# EAGLE design MySens-easyRS485-BluePill-V03-not-ordered-015 (EAGLE 7.6.0)
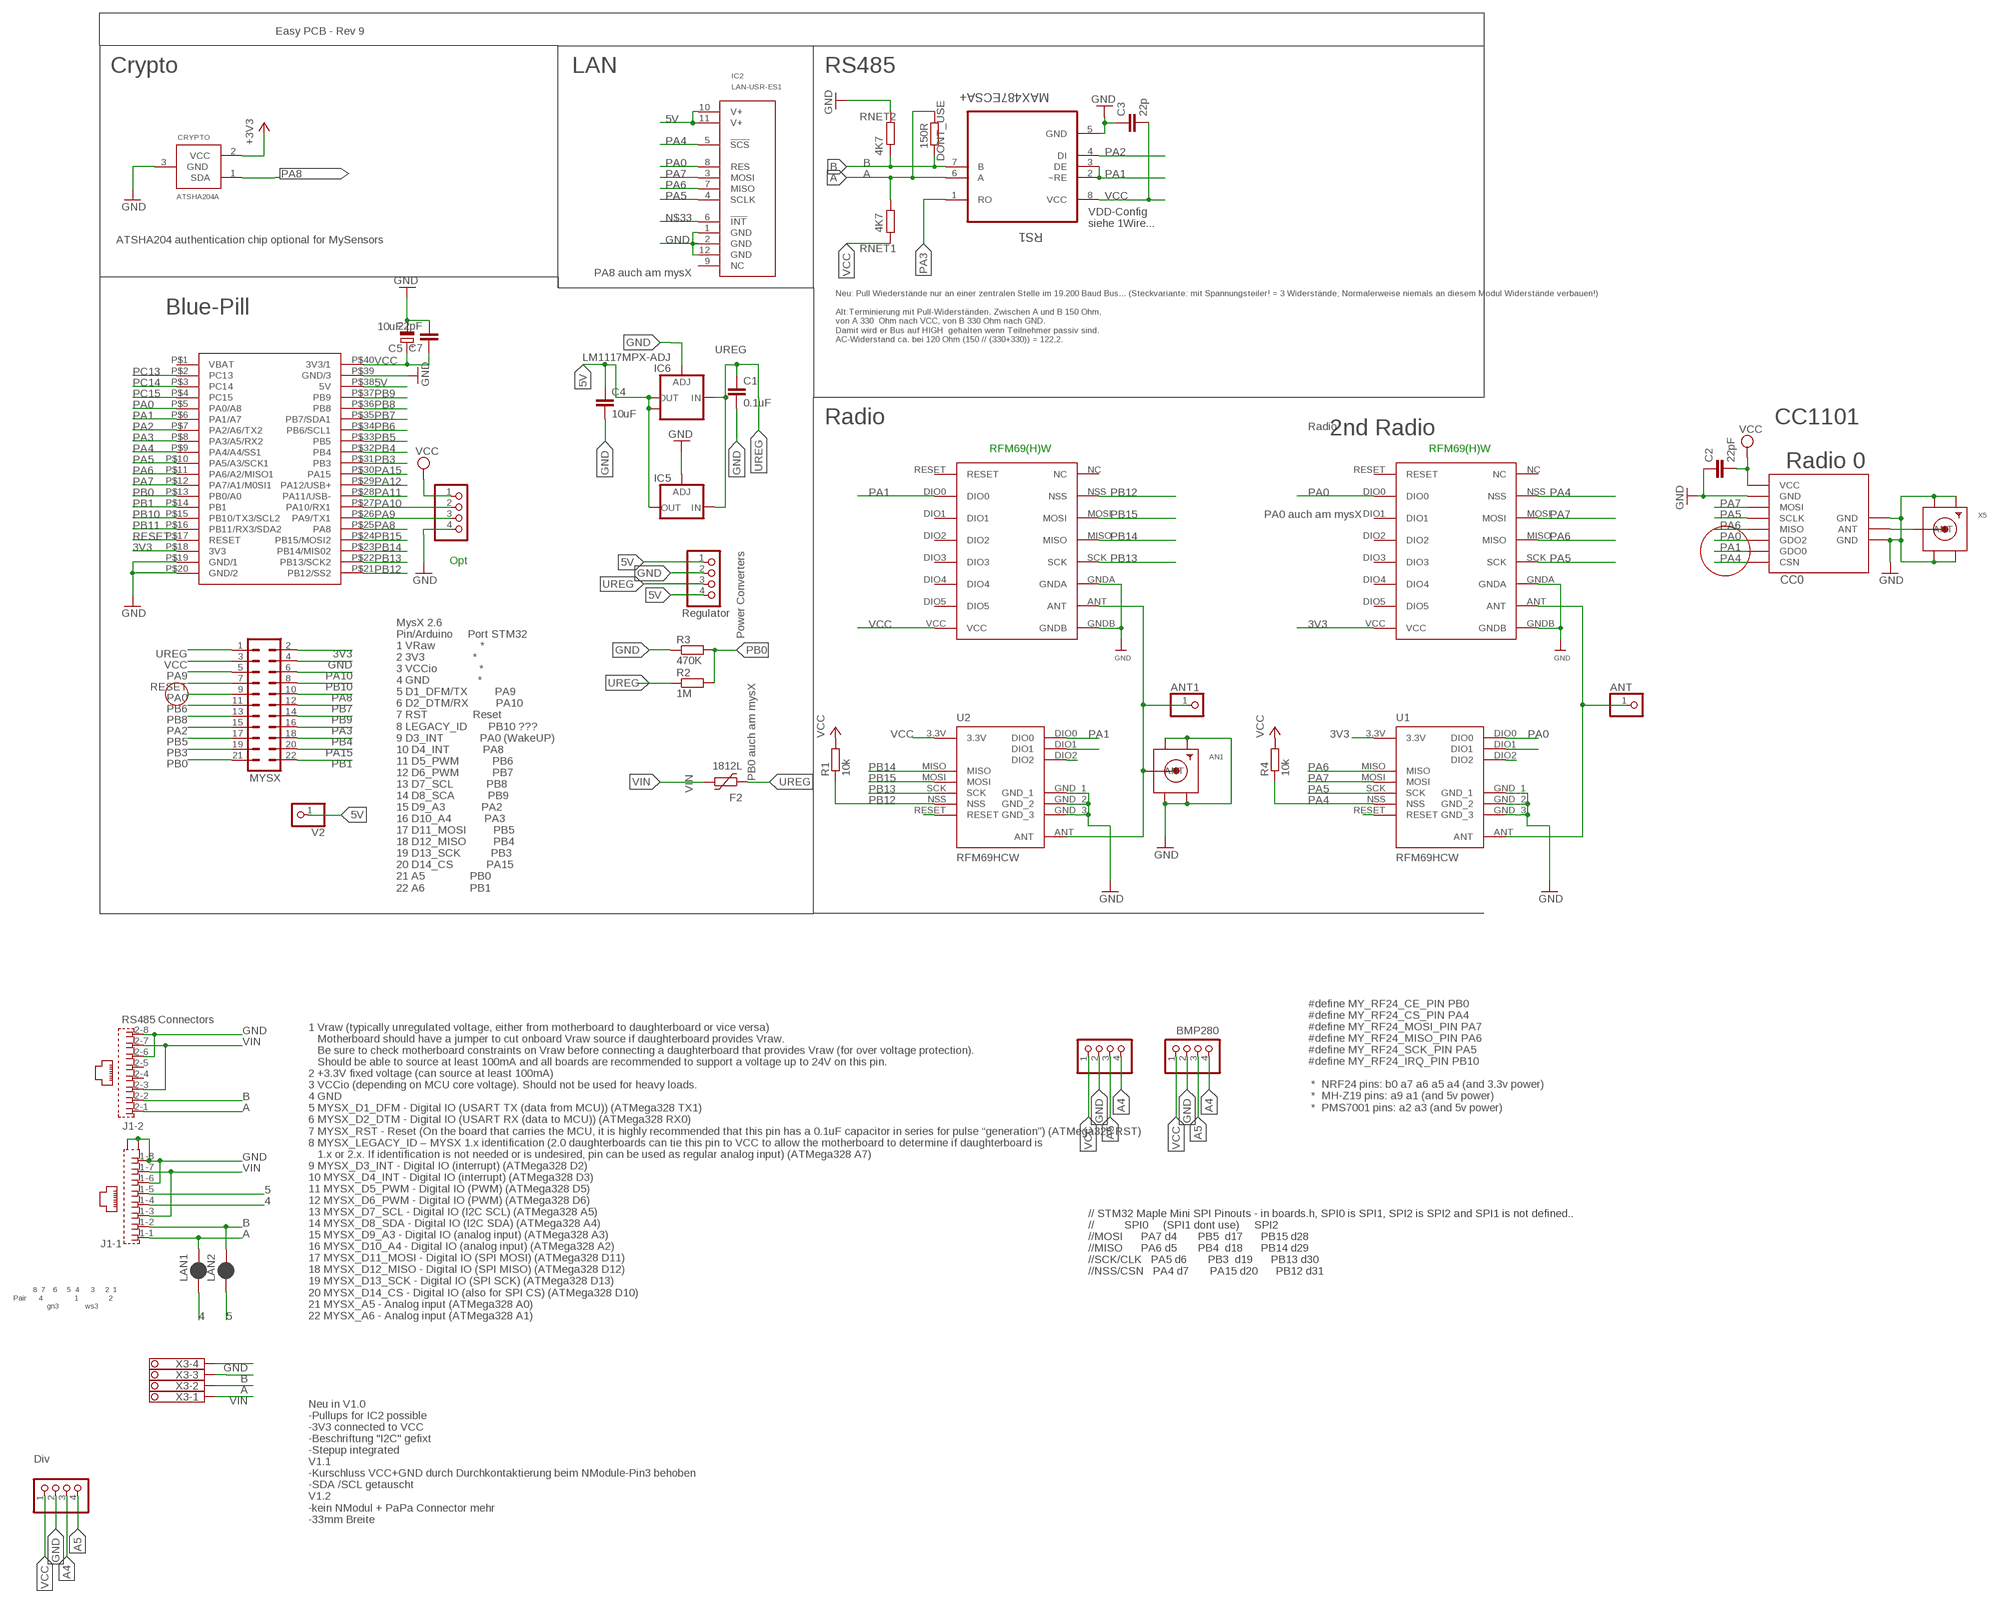
[diagram p0: schematic, sheet 1]

## Parts
AN1  SMACONNECTOR_EDGE  [SMA_EDGELAUNCH]
ANT  PINHD-1X1  [1X01]
ANT1  PINHD-1X1  [1X01]
BH1750  PINHD-1X04_2.54-S  [1X04-S]
C1  0.1uF  C-EUC1206  [C1206]
C2  22pF  C-EUC0805  [C0805]
C3  22p  C-EUC0805  [C0805]
C4  10uF  C-EUC1210  [C1210]
C5  10uF  CPOL-EUR/2012-12W  [R/2012-12W]
C7  22pF  C-EUC0805  [C0805]
CC0  CC1101  CC1101_MODULE1SMD  [CC1101_MODULE1_SMD]
CRYPTO  ATSHA204A  [SOT23]
DBG  PINHD-1X04_2.54-S  [1X04-S]
DONT_USE  150R  R-EU_R0805  [R0805]
F2  1812L  [1812L]
I2C-1  PINHD-1X04_2.54-S  [1X04-S]
I2C-2  PINHD-1X04_2.54-S  [1X04-S]
IC2  LAN-USR-ES1  [USR-ES1]
IC5  LD117ADT50TR  [DPACK]
IC6  LM1117MPX-ADJ  [SOT223]
J1  RJ45_2X_NARROW_SHILDPINS_NOCASE  [RJ45_2X_NARROW_SHILDPINS_NOCASE]
LAN1  JUMPER-SMT_2_NC_PASTE_SILK  [SMT-JUMPER_2_NC_PASTE_SILK]
LAN2  JUMPER-SMT_2_NC_PASTE_SILK  [SMT-JUMPER_2_NC_PASTE_SILK]
MYSX  MA11-2  [MA11-2]
R1  10k  R-EU_M0805  [M0805]
R2  1M  R-EU_R0805  [R0805]
R3  470K  R-EU_R0805  [R0805]
R4  10k  R-EU_M0805  [M0805]
RFM69W  RFM69HW  [RFM]
RFM69W1  RFM69HW  [RFM]
RNET1  4K7  R-EU_R0805  [R0805]
RNET2  4K7  R-EU_R0805  [R0805]
RS1  MAX487ECSA+  [SOIC127P600X175-8N]
STEPDWN  PINHD-1X04_2.54-S  [1X04-S]
U1  RFM69HCW  [RFM69HCW-XXXS2]
U2  RFM69HCW  [RFM69HCW-XXXS2]
U$4  BLUEPILL  [BLUEPILL]
V2  PINHD-1X1  [1X01]
X3  1751264  [1751264]
X5  SMACONNECTOR_EDGE  [SMA_EDGELAUNCH]

## Nets
3V3: CRYPTO.2(VCC) MYSX.2 RFM69W.VCC U1.3.3V U$4.P$18(3V3) ; supply symbol labelled +3V3
4: J1.1-4 LAN1.1
5: J1.1-5 LAN2.1
5V: C4.1 IC2.10(V+) IC2.11(V+) IC5.4(OUT) IC6.2(OUT) IC6.TAB(OUT1) STEPDWN.1 STEPDWN.4 U$4.P$38(5V) V2.1
A: DONT_USE.1 J1.1-1 J1.2-1 LAN1.2 RNET1.2 RS1.6(A) X3.2
A4: BH1750.4 I2C-1.4 I2C-2.3
A5: BH1750.3 I2C-1.3 I2C-2.4
ANT0: CC0.ANT X5.P(ANT)
ANT1: AN1.P(ANT) ANT1.1 RFM69W1.ANT U2.ANT
ANT2: ANT.1 RFM69W.ANT U1.ANT
B: DONT_USE.2 J1.1-2 J1.2-2 LAN2.2 RNET2.1 RS1.7(B) X3.3
GND [PWR]: AN1.GND@1(GND4) AN1.GND@2(GND3) AN1.GND@3(GND2) AN1.GND@4(GND1) BH1750.2 C1.2 C2.1 C3.1 C4.2 C5.- C7.2 CC0.GND@0(GND) CC0.GND@1(GND) CC0.GND@2(GND) CRYPTO.3(GND) DBG.4 I2C-1.2 I2C-2.2 IC2.1(GND) IC2.2(GND) IC2.12(GND) IC5.1(ADJ) IC6.1(ADJ) J1.1-6 J1.1-8 J1.2-6 J1.2-8 J1.G1(-1:S1) J1.G3(-1:S2) MYSX.4 R3.1 RFM69W1.GNDA RFM69W1.GNDB RFM69W.GNDA RFM69W.GNDB RNET2.2 RS1.5(GND) STEPDWN.2 U1.GND_1 U1.GND_2 U1.GND_3 U2.GND_1 U2.GND_2 U2.GND_3 U$4.P$19(GND/1) U$4.P$20(GND/2) U$4.P$39(GND/3) X3.4 X5.GND@1(GND4) X5.GND@2(GND3) X5.GND@3(GND2) X5.GND@4(GND1)
N$1: U1.RESET
N$4: U2.DIO2
N$8: U2.DIO1
N$9: U2.RESET
N$14: U1.DIO2
N$15: U1.DIO1
N$33: IC2.6(!INT!)
PA0: CC0.GDO2 IC2.8(RES) MYSX.9 RFM69W.DIO0 U1.DIO0 U$4.P$5(PA0/A8)
PA1: CC0.GDO0 RFM69W1.DIO0 RS1.2(~RE) RS1.3(DE) U2.DIO0 U$4.P$6(PA1/A7)
PA2: MYSX.15 RS1.4(DI) U$4.P$7(PA2/A6/TX2)
PA3: MYSX.16 RS1.1(RO) U$4.P$8(PA3/A5/RX2)
PA4: CC0.CSN IC2.5(!SCS!) R4.1 RFM69W.NSS U1.NSS U$4.P$9(PA4/A4/SS1)
PA5: CC0.SCLK IC2.4(SCLK) RFM69W.SCK U1.SCK U$4.P$10(PA5/A3/SCK1)
PA6: CC0.MISO IC2.7(MISO) RFM69W.MISO U1.MISO U$4.P$11(PA6/A2/MISO1)
PA7: CC0.MOSI IC2.3(MOSI) RFM69W.MOSI U1.MOSI U$4.P$12(PA7/A1/M0SI1)
PA8: CRYPTO.1(SDA) MYSX.10 U$4.P$25(PA8)
PA9: DBG.3 MYSX.5 U$4.P$26(PA9/TX1)
PA10: DBG.2 MYSX.6 U$4.P$27(PA10/RX1)
PA11: U$4.P$28(PA11/USB-)
PA12: U$4.P$29(PA12/USB+)
PA15: MYSX.20 U$4.P$30(PA15)
PB0: MYSX.21 R2.2 R3.2 U$4.P$13(PB0/A0)
PB1: MYSX.22 U$4.P$14(PB1)
PB3: MYSX.19 U$4.P$31(PB3)
PB4: MYSX.18 U$4.P$32(PB4)
PB5: MYSX.17 U$4.P$33(PB5)
PB6: MYSX.11 U$4.P$34(PB6/SCL1)
PB7: MYSX.12 U$4.P$35(PB7/SDA1)
PB8: MYSX.13 U$4.P$36(PB8)
PB9: MYSX.14 U$4.P$37(PB9)
PB10: MYSX.8 U$4.P$15(PB10/TX3/SCL2)
PB11: U$4.P$16(PB11/RX3/SDA2)
PB12: R1.1 RFM69W1.NSS U2.NSS U$4.P$21(PB12/SS2)
PB13: RFM69W1.SCK U2.SCK U$4.P$22(PB13/SCK2)
PB14: RFM69W1.MISO U2.MISO U$4.P$23(PB14/MIS02)
PB15: RFM69W1.MOSI U2.MOSI U$4.P$24(PB15/MOSI2)
PC13: U$4.P$2(PC13)
PC14: U$4.P$3(PC14)
PC15: U$4.P$4(PC15)
RESET: MYSX.7 U$4.P$17(RESET)
UREG [PWR]: C1.1 F2.P$1 IC5.3(IN) IC6.3(IN) MYSX.1 R2.1 STEPDWN.3
VCC [PWR]: BH1750.1 C2.2 C3.2 C5.+ C7.1 CC0.VCC DBG.1 I2C-1.1 I2C-2.1 MYSX.3 R1.2 R4.2 RFM69W1.VCC RNET1.1 RS1.8(VCC) U2.3.3V U$4.P$40(3V3/1)
VIN [PWR]: F2.P$2 J1.1-3 J1.1-7 J1.2-3 J1.2-7 X3.1
Unconnected: IC2.9(NC) J1.2-4 J1.2-5 RFM69W1.DIO1 RFM69W1.DIO2 RFM69W1.DIO3 RFM69W1.DIO4 RFM69W1.DIO5 RFM69W1.NC RFM69W1.RESET RFM69W.DIO1 RFM69W.DIO2 RFM69W.DIO3 RFM69W.DIO4 RFM69W.DIO5 RFM69W.NC RFM69W.RESET U$4.P$1(VBAT)

## Notes on the sheet
- Easy PCB - Rev 9
- Crypto | LAN | RS485
- VDD-Config
  siehe 1Wire...
- ATSHA204 authentication chip optional for MySensors
- PA8 auch am mysX
- Blue-Pill
- Neu: Pull Wiederstände nur an einer zentralen Stelle im 19.200 Baud Bus... (Steckvariante: mit Spannungsteiler! = 3 Widerstände; Normalerweise niemals an diesem Modul Widerstände verbauen!)
  
  Alt:Terminierung mit Pull-Widerständen. Zwischen A und B 150 Ohm,
  von A 330  Ohm nach VCC, von B 330 Ohm nach GND. 
  Damit wird er Bus auf HIGH  gehalten wenn Teilnehmer passiv sind.
  AC-Widerstand ca. bei 120 Ohm (150 // (330+330)) = 122,2.
- Radio | CC1101
- Radio
- 2nd Radio
- RFM69(H)W | RFM69(H)W
- Radio 0
- PA0 auch am mysX
- Power Converters
- Opt
- Regulator
- PB0 auch am mysX
- MysX 2.6
  Pin/Arduino     Port STM32
  1 VRaw               *
  2 3V3                *
  3 VCCio              *
  4 GND                *
  5 D1_DFM/TX         PA9
  6 D2_DTM/RX         PA10
  7 RST               Reset
  8 LEGACY_ID       PB10 ??? 
  9 D3_INT            PA0 (WakeUP) 
  10 D4_INT           PA8 
  11 D5_PWM           PB6
  12 D6_PWM           PB7
  13 D7_SCL           PB8
  14 D8_SCA           PB9
  15 D9_A3            PA2 
  16 D10_A4           PA3 
  17 D11_MOSI         PB5 
  18 D12_MISO         PB4
  19 D13_SCK          PB3 
  20 D14_CS           PA15
  21 A5               PB0
  22 A6               PB1
- RS485 Connectors
- BMP280
- #define MY_RF24_CE_PIN PB0 
  #define MY_RF24_CS_PIN PA4 
  #define MY_RF24_MOSI_PIN PA7 
  #define MY_RF24_MISO_PIN PA6 
  #define MY_RF24_SCK_PIN PA5 
  #define MY_RF24_IRQ_PIN PB10
  
   *  NRF24 pins: b0 a7 a6 a5 a4 (and 3.3v power)
   *  MH-Z19 pins: a9 a1 (and 5v power)
   *  PMS7001 pins: a2 a3 (and 5v power)
- // STM32 Maple Mini SPI Pinouts - in boards.h, SPI0 is SPI1, SPI2 is SPI2 and SPI1 is not defined..
  //          SPI0     (SPI1 dont use)     SPI2
  //MOSI      PA7 d4       PB5  d17      PB15 d28
  //MISO      PA6 d5       PB4  d18      PB14 d29
  //SCK/CLK   PA5 d6       PB3  d19      PB13 d30
  //NSS/CSN   PA4 d7       PA15 d20      PB12 d31
- 8  7    6     5  4      3     2  1
  Pair      4                1               2
                   gn3             ws3
- 1 Vraw (typically unregulated voltage, either from motherboard to daughterboard or vice versa)
     Motherboard should have a jumper to cut onboard Vraw source if daughterboard provides Vraw. 
     Be sure to check motherboard constraints on Vraw before connecting a daughterboard that provides Vraw (for over voltage protection). 
     Should be able to source at least 100mA and all boards are recommended to support a voltage up to 24V on this pin.
  2 +3.3V fixed voltage (can source at least 100mA)
  3 VCCio (depending on MCU core voltage). Should not be used for heavy loads.
  4 GND
  5 MYSX_D1_DFM - Digital IO (USART TX (data from MCU)) (ATMega328 TX1)
  6 MYSX_D2_DTM - Digital IO (USART RX (data to MCU)) (ATMega328 RX0)
  7 MYSX_RST - Reset (On the board that carries the MCU, it is highly recommended that this pin has a 0.1uF capacitor in series for pulse “generation”) (ATMega328 RST)
  8 MYSX_LEGACY_ID – MYSX 1.x identification (2.0 daughterboards can tie this pin to VCC to allow the motherboard to determine if daughterboard is 
     1.x or 2.x. If identification is not needed or is undesired, pin can be used as regular analog input) (ATMega328 A7)
  9 MYSX_D3_INT - Digital IO (interrupt) (ATMega328 D2)
  10 MYSX_D4_INT - Digital IO (interrupt) (ATMega328 D3)
  11 MYSX_D5_PWM - Digital IO (PWM) (ATMega328 D5)
  12 MYSX_D6_PWM - Digital IO (PWM) (ATMega328 D6)
  13 MYSX_D7_SCL - Digital IO (I2C SCL) (ATMega328 A5)
  14 MYSX_D8_SDA - Digital IO (I2C SDA) (ATMega328 A4)
  15 MYSX_D9_A3 - Digital IO (analog input) (ATMega328 A3)
  16 MYSX_D10_A4 - Digital IO (analog input) (ATMega328 A2)
  17 MYSX_D11_MOSI - Digital IO (SPI MOSI) (ATMega328 D11)
  18 MYSX_D12_MISO - Digital IO (SPI MISO) (ATMega328 D12)
  19 MYSX_D13_SCK - Digital IO (SPI SCK) (ATMega328 D13)
  20 MYSX_D14_CS - Digital IO (also for SPI CS) (ATMega328 D10)
  21 MYSX_A5 - Analog input (ATMega328 A0)
  22 MYSX_A6 - Analog input (ATMega328 A1)
- Div
- Neu in V1.0
  -Pullups for IC2 possible
  -3V3 connected to VCC
  -Beschriftung "I2C" gefixt
  -Stepup integrated
  V1.1
  -Kurschluss VCC+GND durch Durchkontaktierung beim NModule-Pin3 behoben
  -SDA /SCL getauscht
  V1.2
  -kein NModul + PaPa Connector mehr
  -33mm Breite

## Library data of the parts
AN1 X5 = adafruit:SMACONNECTOR: SMA Connector 90° DIP SMA Connector, 50 Ohm (4UConnector: 07259)
ANT ANT1 V2 = pinhead:PINHD-1X1: PIN HEADER
BH1750 DBG I2C-1 I2C-2 STEPDWN = pinhead-2:PINHD-1X04: PIN HEADER
C1-C4 C7 = rcl:C-EU: CAPACITOR, European symbol
C5 = rcl:CPOL-EU: POLARIZED CAPACITOR, European symbol
CC0 = wireless:CC1101_MODULE1: CC1101 wireless module for 433/868 MHz (sold from Aliexpress). DIL version for mounting with pin header (and SMD soldering) and SMD only variant available.
CRYPTO = Sensor:ATSHA204A
DONT_USE R1-R4 RNET1 RNET2 = rcl:R-EU_: RESISTOR, European symbol
F2 = ptc-littlefuse:1812L
IC2 = Martin-Communication:LAN-USR-ES1
IC5 = v-reg:LD117A?*: Low drop fixed and adjustable positive voltage regulators 1 A Source: http://www.st.com/stonline/products/literature/ds/7194/ld1117axx.pdf
IC6 = lm1117:LM1117MPX-ADJ
J1 = RJ45:RJ45_2X_NARROW_SHILDPINS_NOCASE: RJ45 connector
LAN1 LAN2 = SparkFun-Jumpers:JUMPER-SMT_2_NC_PASTE: Normally closed solder jumper This jumper has an aperture in the stencil to allow solder paste to bridge the split in the wire so it's normally closed (NC). Wick off the solder to open the connection. Reapply solder to reclose the connection.
MYSX = con-Pinheader:MA11-2: PIN HEADER; OC_FARNELL: unknown; OC_NEWARK: unknown
RFM69W RFM69W1 = hoperf:RFM69HW
RS1 = Maxim_By_element14_Batch_1:MAX487ECSA+: Low-Power, Slew-Rate-Limited RS-485/RS-422 Transceivers; MPN: MAX487ECSA+; OC_FARNELL: 9724532; OC_NEWARK: 68K4803; PACKAGE: SOIC-8; SUPPLIER: Maxim
U1 U2 = doug:RFM69H
U$4 = stm32duino boards:BLUEPILL
X3 = con-phoenix-350:1751264: MKDS 1/ 4-3,5 Printklemme Nennstrom: 10 A Bemessungsspannung: 160 V Raster: 3,5 mm Polzahl: 4 Montageart: Löten Anschlussart: Schraubanschluss Anschlussrichtung vom Leiter zur Platine: 0° Source: http://eshop.phoenixcontact.com .. 1751264.pdf; MPN: 1751264; OC_FARNELL: unknown; OC_NEWARK: 10R0934

## Net classes
0 default: width 0.254 mm, clearance 0.205 mm
1 PWR: width 0.406 mm, clearance 0.205 mm to class 0, clearance 0.205 mm

## Board
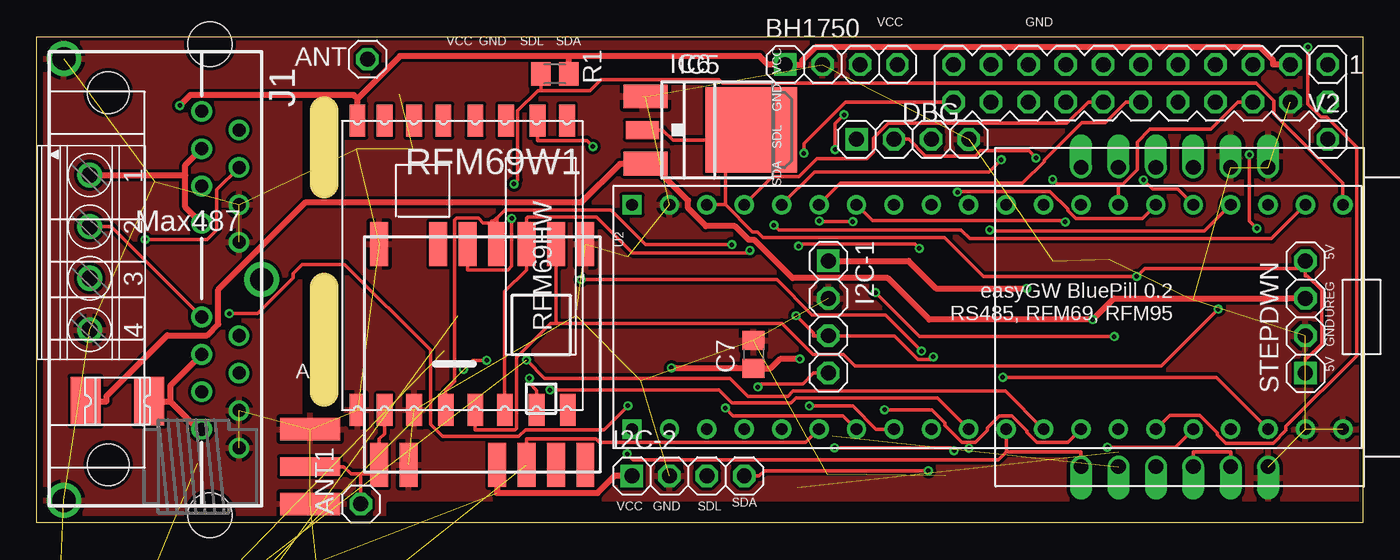
[diagram p1: board, top side]
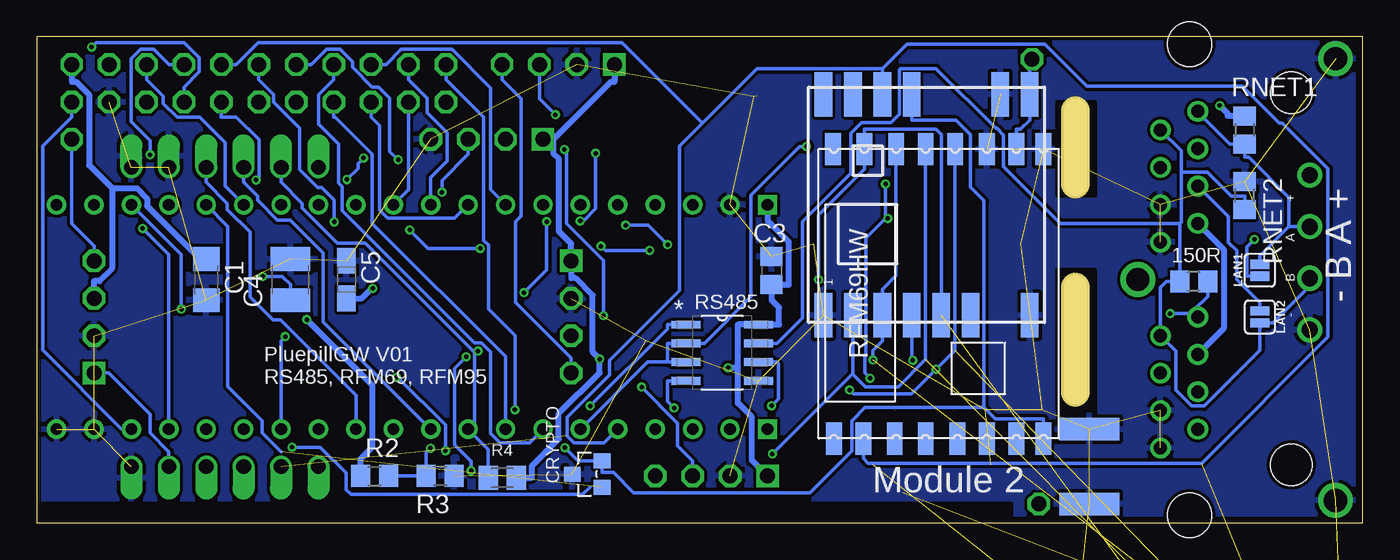
[diagram p2: board, bottom side, seen from below]

Size 90 x 33 mm. Coordinates in mm from the lower left corner, seen from the top.
Outline: 90,0 0,0 0,33 90,33 90,0
Copper layers (1*16): Top 0.035mm / dielectric 1.5mm / Bottom 0.035mm
Design rules "dirt_cheap_dirty_boards.v1": minimum track width 5mil, minimum drill 12mil, track to track 5mil, track to pad 5mil, pad to pad 5mil, via to via 5mil, smd to smd 0mil, copper to edge 10mil, drill to drill 10mil, minimum pad ring 10mil, minimum via ring 6mil, stop-mask expansion 2mil, vias tented up to drill 25mil, thermal gap 10mil
Holes 3 mm at 11.75,0.5 11.75,32.5
tRestrict: area 18.2,22.2 to 20.7,28.6; area 18.2,7.6 to 20.7,17.1; area 23.9,0.6 to 89.9,1.3; 1 lines
bRestrict: area 18.2,22.2 to 20.7,28.6; area 18.2,7.6 to 20.7,17.1; area 23.9,0.6 to 89.9,1.3
Milling: 2 lines

### Footprints (pad centres in the part's own frame; a part is rotated, then mirrored left to right if it is on the bottom)
SMA_EDGELAUNCH = smd 4.064 x 1.524: GND@1 2.032,-2.54; GND@2 2.032,2.54 | smd 4.064 x 1.524 bottom: GND@3 2.032,2.54; GND@4 2.032,-2.54 | smd 4.064 x 1.27: P 2.032,0
1X01 = drill 1.016 octagon: 1 0,0
1X04-S = drill 1.016 square: 1 -3.81,0 | drill 1.016 octagon: 2 -1.27,0; 3 1.27,0; 4 3.81,0
C1206 = smd 1.6 x 1.8: 1 -1.4,0; 2 1.4,0
C0805 = smd 1.3 x 1.5: 1 -0.95,0; 2 0.95,0
C1210 = smd 1.6 x 2.7: 1 -1.4,0; 2 1.4,0
R/2012-12W = smd 1.75 x 1.26: + 1.275,0; - -1.275,0
CC1101_MODULE1_SMD = smd 1.93 x 0.813: ANT 19,5.96; CSN 0,0; GDO0 0,2; GDO2 0,4; GND@0 0,12; GND@1 19,8.5; GND@2 19,3.42; MISO 0,6; MOSI 0,10; SCLK 0,8; VCC 0,14
SOT23 = smd 1.016 x 1.143: 1 -0.889,-1.016; 2 0.889,-1.016; 3 0,1.016
R0805 = smd 1.3 x 1.5: 1 -0.95,0; 2 0.95,0
1812L = smd 2.03 x 3.3: P$1 -2.16,0; P$2 2.16,0
USR-ES1 = drill 1 pad 1.35 offset: 1 -10.16,5.715; 2 -10.16,3.175; 3 -10.16,0.635; 4 -10.16,-1.905; 5 -10.16,-4.445; 6 -10.16,-6.985; 7 10.16,-6.985; 8 10.16,-4.445; 9 10.16,-1.905; 10 10.16,0.635; 11 10.16,3.175; 12 10.16,5.715
DPACK = smd 1.6 x 3: 1 -2.28,-4.8; 3 2.28,-4.8 | smd 5.8 x 6.2: 4 0,2.38
SOT223 = smd 1.219 x 2.235: 1 -2.311,-3.099; 2 0,-3.099; 3 2.311,-3.099 | smd 3.6 x 2.2: TAB 0,3.099
RJ45_2X_NARROW_SHILDPINS_NOCASE = drill 0.889: 1-1 -11.43,6.35; 1-2 -10.16,8.89; 1-3 -8.89,6.35; 1-4 -7.62,8.89; 1-5 -6.35,6.35; 1-6 -5.08,8.89; 1-7 -3.81,6.35; 1-8 -2.54,8.89; 2-1 2.54,6.35; 2-2 3.81,8.89; 2-3 5.08,6.35; 2-4 6.35,8.89; 2-5 7.62,6.35; 2-6 8.89,8.89; 2-7 10.16,6.35; 2-8 11.43,8.89 | drill 1.575 pad 2.184: G1 -15,-3; G2 0,10.414; G3 15,-3 | hole 2.8: -12.7,0; 12.573,0
SMT-JUMPER_2_NC_PASTE_SILK = smd 0.635 x 1.27: 1 -0.406,0; 2 0.406,0
MA11-2 = drill 1.016 octagon: 1 -12.7,-1.27; 2 -12.7,1.27; 3 -10.16,-1.27; 4 -10.16,1.27; 5 -7.62,-1.27; 6 -7.62,1.27; 7 -5.08,-1.27; 8 -5.08,1.27; 9 -2.54,-1.27; 10 -2.54,1.27; 11 0,-1.27; 12 0,1.27; 13 2.54,-1.27; 14 2.54,1.27; 15 5.08,-1.27; 16 5.08,1.27; 17 7.62,-1.27; 18 7.62,1.27; 19 10.16,-1.27; 20 10.16,1.27; 21 12.7,-1.27; 22 12.7,1.27
M0805 = smd 1.3 x 1.6: 1 -0.95,0; 2 0.95,0
RFM = smd 2.184 x 1.067: ANT 19.651,2.889; DIO0 0,13.27; DIO1 0,11.143; DIO2 0,9.047; DIO3 0,6.889; DIO4 0,4.889; DIO5 0,2.889; GNDA 19.651,4.889; GNDB 19.651,1.048; MISO 19.651,9.047; MOSI 19.651,11.047; NC 19.651,15.334; NSS 19.651,13.206; RESET 0,15.27; SCK 19.651,7.048; VCC 0,1.048
SOIC127P600X175-8N = smd 1.981 x 0.533: 1 -2.464,1.905; 2 -2.464,0.635; 3 -2.464,-0.635; 4 -2.464,-1.905; 5 2.464,-1.905; 6 2.464,-0.635; 7 2.464,0.635; 8 2.464,1.905
RFM69HCW-XXXS2 = smd 3 x 1.2: 3.3V 7.5,1; ANT 7.5,-7; DIO0 7.5,3; DIO1 7.5,5; DIO2 7.5,7; GND_1 7.5,-5; GND_2 -7.5,-7; GND_3 -7.5,7; MISO -7.5,5; MOSI -7.5,3; NSS -7.5,-1; RESET -7.5,-3; SCK -7.5,1
BLUEPILL = drill 0.8 square: P$1 -7.62,22.86; P$40 7.62,22.86 | drill 0.8: P$2 -7.62,20.32; P$3 -7.62,17.78; P$4 -7.62,15.24; P$5 -7.62,12.7; P$6 -7.62,10.16; P$7 -7.62,7.62; P$8 -7.62,5.08; P$9 -7.62,2.54; P$10 -7.62,0; P$11 -7.62,-2.54; P$12 -7.62,-5.08; P$13 -7.62,-7.62; P$14 -7.62,-10.16; P$15 -7.62,-12.7; P$16 -7.62,-15.24; P$17 -7.62,-17.78; P$18 -7.62,-20.32; P$19 -7.62,-22.86; P$20 -7.62,-25.4; P$21 7.62,-25.4; P$22 7.62,-22.86; P$23 7.62,-20.32; P$24 7.62,-17.78; P$25 7.62,-15.24; P$26 7.62,-12.7; P$27 7.62,-10.16; P$28 7.62,-7.62; P$29 7.62,-5.08; P$30 7.62,-2.54; P$31 7.62,0; P$32 7.62,2.54; P$33 7.62,5.08; P$34 7.62,7.62; P$35 7.62,10.16; P$36 7.62,12.7; P$37 7.62,15.24; P$38 7.62,17.78; P$39 7.62,20.32
1751264 = drill 1.1 pad 1.7: 1 -5.25,-0.1; 2 -1.75,-0.1; 3 1.75,-0.1; 4 5.25,-0.1

### Placement (x,y rotation side)
AN1  16.51,3.81 0 top
ANT  22.45,31.48 0 top
ANT1  21.98,1.27 0 top
BH1750  54.61,31.11 0 top
C1  78.5,16.51 270 bottom
C2  15.88,-28.57 0 top  (outside the outline)
C3  40.12,17.12 270 bottom
C4  72.78,16.51 90 bottom
C5  68.97,16.51 270 bottom
C7  48.66,11.43 90 top
CC0  1.27,-23.5 0 top  (outside the outline)
CRYPTO  52.64,3.3 90 bottom
DBG  59.45,26.04 0 top
DONT_USE  11.46,16.38 180 bottom
F2  5.47,8.26 0 top
I2C-1  53.73,13.97 270 top
I2C-2  44.21,3.17 0 top
IC2  77.86,13.97 270 top
IC5  46.12,26.67 270 top
IC6  44.21,26.67 270 top
J1  4.84,16.51 270 top
LAN1  6.99,17.14 90 bottom
LAN2  6.99,13.97 270 bottom
MYSX  74.93,29.84 180 top
R1  35.16,30.48 0 top
R2  67.07,3.17 0 bottom
R3  62.62,3.17 180 bottom
R4  58.41,3.05 0 bottom
RFM69W  20.62,5.71 90 bottom
RFM69W1  20.71,27.3 270 top
RNET1  8.02,26.67 270 bottom
RNET2  8.02,22.23 90 bottom
RS1  43.48,11.54 0 bottom
STEPDWN  86.12,13.97 90 top
U1  29.61,21.59 90 bottom
U2  30.24,11.43 270 top
U$4  63.26,13.97 90 top
V2  87.63,26.04 0 top
X3  3.69,18.35 270 top
X5  9.53,-33.02 0 top  (outside the outline)

### Tracks (layer width: path | path; a pad name or v marks a point on that pad's centre or on a via)
3V3  (via drill 0.3 pad 0.61)
  Top 0.254: v62.25,4.89 62.05,5.09 v54.16,5.09 | U$4.P$18 80.06,9.87 v65.57,9.87
  Bottom 0.254: MYSX.2 87.63,27.56 89.61,25.58 89.61,11.74 84.22,6.35 U$4.P$18 | v54.16,5.09 53.25,4.19 CRYPTO.2 51.62,3.43 50.86,3.43 49.48,2.04 37.52,2.04 34.68,4.89 34.68,6.92 33.77,7.82 25.7,7.82 | v65.57,9.87 65.5,9.87 62.25,6.63 v62.25,4.89 | 25.7,7.82 25.7,21.86 26.63,22.79 26.63,26.36 27.61,27.34 30.61,27.34 U1.3.3V | 25.7,7.82 24.94,7.06 21.67,7.06 RFM69W.VCC
4  (via drill 0.3 pad 0.61)
  Top 0.254: v7.35,19.24 11.57,19.24 12.22,19.89 12.22,22.62 J1.1-4
  Bottom 0.254: LAN1.1 7.87,16.74 7.87,18.71 v7.35,19.24
5
  Bottom 0.254: LAN2.1 6.99,14.95 8.55,16.51 8.55,18.49 9.11,19.05 9.11,20.78 J1.1-5
5V  (via drill 0.3 pad 0.61)
  Top 0.254: IC6.2 42.48,26.67 43.17,25.98 47.31,25.98 | 47.31,25.98 47.31,24.62 46.74,24.04 46.74,21.59 | 47.31,25.98 IC6.TAB IC5.4 | 46.74,21.59 48.59,19.73 48.93,19.73 49.28,19.38 61.6,19.38 64.25,16.73 v74.67,16.73 75.21,17.27 86.12,17.27 | 46.74,21.59 | 46.74,21.59 U$4.P$38 | 86.12,17.27 86.12,16.76 86.25,16.76 87.22,15.79 87.22,12.15 86.25,11.18 86.12,11.18 STEPDWN.1 | STEPDWN.4 86.12,17.27 | IC2.10 78.5,4.82 81.04,4.82 IC2.11
  Bottom 0.254: C4.1 72.78,16.16 73.35,16.73 v74.67,16.73 | STEPDWN.4 86.12,18.8 87.63,20.31 V2.1 | STEPDWN.1 85.1,10.16 82.31,7.37 82.31,6.09 81.04,4.82 IC2.11
A  (via drill 0.3 pad 0.61)
  Top 0.254: v40.12,7.94 38.49,6.31 33.16,6.31 32.71,5.85 27.55,5.85 26.72,6.67 26.72,11.73 20.91,17.54 18.03,17.54 17.4,16.92 17.4,16.62 14.97,14.2 v13.06,14.2 | J1.2-1 5.06,20.1 X3.2
  Bottom 0.254: RS1.6 39.77,10.91 39.66,10.81 39.66,8.4 v40.12,7.94 | 11.41,14.2 J1.2-1 | 11.41,14.2 11.41,14.48 10.52,15.38 DONT_USE.1 | v13.06,14.2 11.41,14.2 | J1.1-1 11.19,27.89 9.02,25.72 RNET1.2 8.02,24.82 7.74,24.82 5.01,22.08 5.01,20.1 | X3.2 5.01,20.1 | 5.01,20.1 6.99,18.12 LAN1.2
A4  (via drill 0.3 pad 0.61)
  Top 0.254: I2C-1.4 52.72,10.16 52,9.44 49.19,9.44 v48.95,9.21
  Bottom 0.254: BH1750.4 58.42,30.1 57.12,28.8 57.12,20.84 57.52,20.44 57.52,14.96 53.73,11.18 I2C-1.4 | I2C-2.3 45.48,4.19 46.5,5.21 46.5,6.75 v48.95,9.21
A5  (via drill 0.3 pad 0.61)
  Top 0.254: v60.86,11.26 60.69,11.1 59.83,11.1 58.22,12.7 I2C-1.3 52.72,12.7 52.72,12.88 v51.54,14.06 | v54.19,25.35 54.19,27.1 v54.79,27.7 | I2C-2.4 49.04,3.17 49.39,3.53 v60.52,3.53
  Bottom 0.254: v54.79,27.7 55.88,28.79 BH1750.3 | v51.54,14.06 51.54,17.82 54.03,20.31 54.03,25.19 v54.19,25.35 | v60.52,3.53 60.52,4.17 61.65,5.3 61.65,10.47 v60.86,11.26
ANT0  (1 unrouted)
ANT1  (1 unrouted)
  Top 0.254: 21.98,3.3 21.34,3.3 20.83,3.81 AN1.P | 21.98,3.3 22.61,3.3 U2.ANT 23.24,5.68 23.6,6.05 RFM69W1.ANT | 21.98,3.3 ANT1.1
ANT2  (1 unrouted)
  Bottom 0.254: RFM69W.ANT 23.51,26.71 23.23,26.71 22.61,27.34 U1.ANT 22.61,30.84 22.45,31 ANT.1
B
  Bottom 0.254: X3.3 3.59,16.07 6.1,13.56 LAN2.2 6.99,11.71 10.76,7.93 11.59,7.93 12.68,9.02 12.68,11.65 J1.2-2 13.73,15.97 13.32,16.38 DONT_USE.2 12.41,17.38 12.41,20.32 | 12.41,20.32 20.52,20.32 24.37,24.18 24.37,26.34 24.83,26.79 24.9,26.79 28.95,30.84 31.38,30.84 31.46,30.77 31.46,27.74 32.03,27.17 34.03,27.17 34.75,26.45 34.75,23.75 38.03,20.47 38.03,13.92 39.77,12.18 RS1.7 | 12.32,23.82 12.32,20.41 12.41,20.32 | J1.1-2 12.32,25.26 12.32,23.82 | 12.32,23.82 10.55,23.82 8.92,22.18 8.02,22.18 RNET2.1
GND  (51 unrouted)
  pour Top: 0.64,35.56 89.53,35.56 89.53,0.64 0.64,0.64
  pour Bottom: 0.64,35.56 89.53,35.56 89.53,0.64 0.64,0.64
PA0  (2 unrouted)
  Bottom 0.254: U$4.P$5 51.49,5.42 53.53,5.42 54.01,5.9 54.01,7.17 51.14,10.04 51.14,11.01 46.39,15.76 46.39,25.57 44.81,27.15 | 32.6,30.84 30.95,32.5 21.56,32.5 18.73,29.66 8.17,29.66 5.65,27.14 5.46,27.14 2.37,24.06 2.37,12.61 10.93,4.05 33.57,4.05 33.89,4.37 RFM69W.DIO0 | 44.81,27.15 41.12,30.84 32.6,30.84 | U1.DIO0 32.6,30.84 | 44.81,27.15 50.27,32.61 74.96,32.61 76.45,31.11 MYSX.9
PA1  (via drill 0.3 pad 0.61)  (1 unrouted)
  Top 0.254: U2.DIO0 33.24,5.68 37.95,5.68 38.19,5.44 52.19,5.44 U$4.P$6 | RFM69W1.DIO0 33.98,25.96 37.35,25.96 v37.75,25.55
  Bottom 0.254: v37.75,25.55 38.22,25.55 41.51,22.27 41.51,15.37 44.69,12.18 RS1.2 47.18,12.18 47.18,10.91 | 47.18,10.91 48.54,10.91 U$4.P$6 | 47.18,10.91 46.71,10.91 RS1.3
PA2  (via drill 0.3 pad 0.61)
  Top 0.254: U$4.P$7 54.73,7.26 47.27,7.26 v46.74,7.79
  Bottom 0.254: U$4.P$7 56.57,5.42 58.56,5.42 59.21,6.08 59.21,11.6 59.83,12.21 60.29,12.21 69.27,21.2 69.27,22.83 69.51,23.08 69.51,25.71 70.88,27.07 70.88,29.07 69.85,30.1 MYSX.15 | v46.74,7.79 47.18,8.24 47.18,9.64 RS1.4
PA3  (via drill 0.3 pad 0.61)
  Top 0.254: U$4.P$8 56.95,6.35 55.39,7.92 v52.43,7.92
  Bottom 0.254: MYSX.16 69.85,27.56 69.75,27.56 67.23,25.05 67.23,20.33 58.18,11.28 U$4.P$8 | RS1.1 47.18,13.45 47.18,13.17 v52.43,7.92
PA4  (via drill 0.3 pad 0.61)  (2 unrouted)
  Top 0.254: v36.94,16.51 50.24,16.51 52.62,14.12 57.59,14.12 v60.06,11.66
  Bottom 0.254: 60.27,11.62 60.34,11.62 67.72,19 69.63,19 71.99,21.36 71.99,21.69 73.42,23.12 IC2.5 | v60.06,11.66 60.09,11.62 60.27,11.62 | 60.27,11.62 60.27,6.8 U$4.P$9 59.35,4.99 59.35,4.1 R4.1 | v36.94,16.51 36.94,20.91 33.83,24.02 RFM69W.NSS 33.83,26.04 33.83,26.71 28.98,26.71 28.61,26.34 U1.NSS
PA5  (via drill 0.3 pad 0.61)  (2 unrouted)
  Top 0.254: U$4.P$10 61.13,8.48 51.53,8.48 51.19,8.13 47.19,8.13 46.32,9 v34.82,9 | v28.97,10.41 29.59,11.03 v30.54,11.03
  Bottom 0.254: IC2.4 75.96,23.12 75.02,22.18 75.02,21.9 73.69,20.57 72.8,20.57 70.55,18.32 70.55,13.64 U$4.P$10 | v34.82,9 34.58,8.76 30.62,8.76 v28.97,10.41 27.67,11.71 RFM69W.SCK | v30.54,11.03 30.61,11.09 U1.SCK
PA6  (via drill 0.3 pad 0.61)  (2 unrouted)
  Top 0.254: 65.8,4.82 65.26,4.28 40.46,4.28 v40.08,4.67 | 65.8,4.82 70.88,4.82 IC2.7 | 65.8,4.82 U$4.P$11
  Bottom 0.254: 34.6,10.07 34.6,12.34 U1.MISO | 34.6,10.07 33.77,9.24 31.52,9.24 29.67,11.09 29.67,24.02 RFM69W.MISO | 34.6,10.07 34.66,10.07 v40.08,4.67
PA7  (via drill 0.3 pad 0.61)  (2 unrouted)
  Top 0.254: U$4.P$12 65.75,8.94 51.34,8.94 51,8.59 48.27,8.59 47.06,9.8 34.48,9.8 v33.23,11.05
  Bottom 0.254: IC2.3 78.5,23.12 77.07,21.69 77.07,21.27 75.52,19.73 75.52,15.32 73.96,13.75 73.44,13.75 68.34,8.65 U$4.P$12 | v33.23,11.05 33.23,11.71 32.6,12.34 U1.MOSI 32.6,14.74 32.6,15.84 31.67,16.78 31.67,24.02 RFM69W.MOSI
PA8  (via drill 0.3 pad 0.61)  (1 unrouted)
  Top 0.254: U$4.P$25 77.44,22.65 75.75,22.65 v75.12,23.27
  Bottom 0.254: MYSX.10 77.47,27.56 76.45,27.56 74.91,26.01 74.91,23.49 v75.12,23.27 | U$4.P$25 77.03,20.12 77.03,9.26 74.69,6.92 74.69,6.09 73.42,4.82
PA9  (via drill 0.3 pad 0.61)
  Top 0.254: v62.5,22.44 62.55,22.5 68.78,22.5 69.97,21.31 69.97,21.21 70.53,20.66 75.03,20.66 U$4.P$26
  Bottom 0.254: DBG.3 60.72,25.02 62.5,23.24 v62.5,22.44 | U$4.P$26 77.23,22.86 77.23,25.8 78.96,27.53 80.48,27.53 81.41,28.46 81.41,28.96 82.55,30.1 MYSX.5
PA10  (via drill 0.3 pad 0.61)
  Top 0.254: DBG.2 59.2,26.04 60.33,24.9 63.71,24.9 64.07,25.26 67.33,25.26 v67.83,24.76 | v68.95,23.31 69.26,23 73.42,23 | 73.42,23 U$4.P$27 | 73.42,23 73.72,23 74.69,23.97 74.69,25.86 75.55,26.72 79.68,26.72 81.53,28.57 MYSX.6
  Bottom 0.254: v67.83,24.76 68.2,24.39 | 68.2,24.39 | 68.2,24.39 68.2,24.06 v68.95,23.31
PA15
  Bottom 0.254: U$4.P$30 64.77,22.62 MYSX.20
PB0  (via drill 0.3 pad 0.61)
  Top 0.254: 63.29,5.44 63.71,5.44 64.53,6.26 64.53,6.44 65.35,7.26 66.18,7.26 67.21,6.23 67.21,6.13 67.89,5.44 69.97,5.44 U$4.P$13 | v57.54,7.68 60.75,7.68 61.63,6.79 61.63,6.62 62.8,5.44 63.29,5.44 | 63.29,5.44 v63.29,5.05
  Bottom 0.254: v63.29,5.05 63.58,4.76 R3.2 64.48,3.17 65.22,3.17 R2.2 | v57.54,7.68 57.54,12.71 59.35,14.53 59.35,18.86 59.66,19.17 59.66,27.53 62.23,30.1 MYSX.21
PB1  (via drill 0.3 pad 0.61)
  Top 0.254: v52.06,25.09 52.06,25.76 54.88,28.57 61.21,28.57 MYSX.22 | v73.13,12.64 59.92,12.64 v56.93,15.63 | v55.39,20.44 53.16,20.44 v53.11,20.49
  Bottom 0.254: U$4.P$14 73.42,12.35 v73.13,12.64 | v53.11,20.49 52.9,20.49 52.06,21.32 v52.06,25.09 | v55.39,20.44 55.39,17.17 v56.93,15.63
PB3
  Bottom 0.254: U$4.P$31 63.26,23.44 62.15,24.55 62.15,26.49 63.5,27.84 63.5,28.83 64.77,30.1 MYSX.19
PB4
  Bottom 0.254: MYSX.18 67.31,27.56 66.73,26.98 66.73,21.24 66.18,20.68 61.63,20.68 U$4.P$32
PB5
  Bottom 0.254: U$4.P$33 59.2,22.61 59.2,29.52 61.83,32.15 65.26,32.15 66.29,31.11 MYSX.17
PB6  (via drill 0.3 pad 0.61)
  Top 0.254: v69.8,20.43 69.73,20.51 56.72,20.51 U$4.P$34
  Bottom 0.254: MYSX.11 74.93,30.1 73.91,29.08 73.91,28.58 72.15,26.81 72.15,23.97 70.95,22.76 70.67,22.76 69.8,21.9 v69.8,20.43
PB7
  Top 0.254: U$4.P$35 54.56,23.05 66.92,23.05 68.39,24.53 68.39,24.63 70.94,27.18 72.52,27.18 73.91,28.57 MYSX.12
PB8  (via drill 0.3 pad 0.61)
  Top 0.254: U$4.P$36 52.79,23.82 64.64,23.82 v65.47,24.65
  Bottom 0.254: MYSX.13 71.37,31.11 70.34,32.15 69.42,32.15 68.58,31.31 68.58,30.94 67.23,29.59 66.81,29.59 66.04,28.82 66.04,25.21 v65.47,24.65
PB9
  Top 0.254: MYSX.14 71.37,28.57 69.93,27.13 57.81,27.13 56.79,26.11 56.79,25.17 56.36,24.74 52.95,24.74 51.72,23.52 49.95,23.52 U$4.P$37
PB10  (via drill 0.3 pad 0.61)
  Top 0.254: U$4.P$15 76.91,7.3 78.94,7.3 80.13,6.11 80.13,5.97 80.72,5.39 83.93,5.39 84.8,6.26 84.8,6.53 89.61,11.34 89.61,25.49 87.57,27.54 87.18,27.54 86.28,28.44 v86.28,32.29
  Bottom 0.254: MYSX.8 80.01,29.59 78.98,30.62 78.98,31.58 80.01,32.61 85.96,32.61 v86.28,32.29
PB11  (via drill 0.3 pad 0.61)
  Top 0.254: U$4.P$16 77.28,5.13 v72.68,5.13
  Bottom 0.254: v72.68,5.13 70.77,5.13 69.01,3.37 69.01,2.25 68.68,1.92 52.94,1.92 52.45,2.41
PB12  (via drill 0.3 pad 0.61)  (1 unrouted)
  Top 0.254: U2.NSS 29.24,17.18 31.99,17.18 32.24,17.42 v32.24,20.67 | 34.22,29.35 37.56,29.35 38.31,30.1 46.3,30.1 46.55,29.84 82.78,29.84 83.96,28.67 83.96,27.77 88.66,23.06 U$4.P$21 | v32.38,23.01 32.65,23.27 32.65,27.97 34.02,29.35 34.22,29.35 | 34.22,29.35 34.22,29.43 R1.1 | RFM69W1.NSS 33.92,9 33.44,9.49 v33.44,9.81
  Bottom 0.254: 32.38,20.67 v32.38,23.01 | v33.44,9.81 33.79,10.17 33.79,11.28 33.71,11.36 33.71,19.34 32.38,20.67 | v32.24,20.67 32.38,20.67
PB13  (via drill 0.3 pad 0.61)  (1 unrouted)
  Top 0.254: 31.24,20.68 31.19,20.68 30.98,20.47 30.88,20.47 30.77,20.36 30.31,20.36 29.98,20.68 28.49,20.68 28.36,20.56 28.36,9.6 27.76,9 RFM69W1.SCK | v47.17,18.89 41.31,18.89 38.97,21.23 31.79,21.23 31.24,20.68 | U$4.P$22 83.81,19.28 63.32,19.28 62.73,19.88 50.37,19.88 v50.03,20.21 | U2.SCK 31.24,20.68
  Bottom 0.254: v50.03,20.21 48.5,20.21 v47.17,18.89
PB14  (via drill 0.3 pad 0.61)  (1 unrouted)
  Top 0.254: 35.24,13.54 50.58,13.54 52.69,11.43 54.75,11.43 55.54,10.64 76.32,10.64 v80.2,14.51 | 35.24,13.54 34.87,13.54 32.55,11.22 32.55,6.39 32.47,6.31 29.76,6.31 RFM69W1.MISO | 35.24,13.54 35.24,17.18 U2.MISO
  Bottom 0.254: v80.2,14.51 80.2,18.21 U$4.P$23
PB15  (via drill 0.3 pad 0.61)  (1 unrouted)
  Top 0.254: v64.69,19.89 64.77,19.81 79.26,19.81 U$4.P$24 | v51.71,18.78 51.84,18.92 59.62,18.92 v59.91,18.63 | v48.41,18.49 48.24,18.32 40.44,18.32 38,20.76 33.32,20.76 33.24,20.68 U2.MOSI 33.24,18.17 33.24,17.18 31.76,15.7 RFM69W1.MOSI
  Bottom 0.254: v59.91,18.63 63.43,18.63 v64.69,19.89 | v48.41,18.49 51.41,18.49 v51.71,18.78
RESET  (via drill 0.3 pad 0.61)
  Top 0.254: v82.82,19.98 82.31,20.5 v82.31,25
  Bottom 0.254: MYSX.7 81.03,31.11 82.06,32.15 82.95,32.15 83.59,31.51 83.59,27.24 82.31,25.95 v82.31,25 | U$4.P$17 81.04,18.2 v82.82,19.98
UREG  (via drill 0.3 pad 0.61)
  Top 0.406: F2.P$1 4.74,8.26 4.74,8.61 8.85,12.73 11.56,12.73 12.32,13.49 12.32,15.84 18.25,21.77 36.99,21.77 39.59,24.36 IC6.3 41.2,24.36 | 41.2,24.36 41.73,24.36 44.21,21.88 44.21,21.36 45.42,20.15 47.38,20.15 48.33,19.2 48.7,19.2 51.3,16.6 57.77,16.6 60.57,13.8 v71.68,13.8 73.12,15.24 84.95,15.24 STEPDWN.3 | 41.2,24.36 41.28,24.36 IC5.3
  Bottom 0.406: 84.9,22.71 83.2,22.71 82.52,22.03 82.52,21.51 78.92,17.91 C1.1 | 84.9,22.71 86.46,24.27 86.46,29.07 87.34,29.95 87.63,29.95 MYSX.1 | 84.9,22.71 84.9,17.28 85.76,16.41 86.12,16.41 STEPDWN.3 | R2.1 68.02,4.33 67.23,5.12 67.23,9.35 v71.68,13.8
VCC  (via drill 0.3 pad 0.61)  (2 unrouted)
  Top 0.406: 21.76,28.8 21.52,29.05 10.41,29.05 v9.71,28.34 | 21.76,28.8 21.76,28.77 RFM69W1.VCC | 36.12,31.69 24.64,31.69 21.76,28.8 | 36.12,31.69 49.06,31.69 49.63,31.11 BH1750.1 51.38,31.11 51.97,31.11 51.97,31.41 52.85,32.28 83.04,32.28 83.92,31.41 83.92,31.11 MYSX.3 | I2C-2.1 39.23,3.17 38.08,2.02 31.24,2.02 U2.3.3V | R1.2 36.12,31.69 | I2C-1.1 59.16,17.78 61.04,15.91 v67.2,15.91 | v51.8,11.12 50.45,11.12 49.81,10.48 C7.1 47.5,10.48 47.47,10.51 v43.07,10.51
  Bottom 0.406: 54.93,26.04 54.93,25.08 54.56,24.72 54.56,19.78 53.73,18.95 I2C-1.1 53.73,16.61 53.44,16.61 52.27,15.44 52.27,11.59 v51.8,11.12 51.8,10.18 54.57,7.41 54.57,5.69 56.4,3.86 56.4,3.05 R4.2 | 54.93,26.04 51.02,29.95 50.8,29.95 BH1750.1 | 54.93,26.04 DBG.1 | RNET1.1 9.17,27.62 9.17,27.81 v9.71,28.34 | C5.+ 67.94,15.23 67.26,15.91 v67.2,15.91 | 42.41,10.51 42.41,13.45 RS1.8 39.61,13.45 39.61,14.61 40.12,15.12 C3.2 38.96,16.18 38.96,19.09 40.4,20.53 U$4.P$40 | I2C-2.1 41.46,4.24 41.46,7.18 42.41,8.12 42.41,10.51 | 42.41,10.51 v43.07,10.51
VIN
  Top 0.406: J1.2-7 10.96,6.35 9.06,8.26 | F2.P$2 9.06,8.26 | J1.2-3 9.06,9.3 9.06,8.26 | 10.08,23.6 10.08,24.29 J1.1-3 | J1.1-7 10.08,21.43 10.08,23.6 | X3.1 10.08,23.6
  Bottom 0.406: J1.1-7 9.44,18.57 9.44,13.18 J1.2-3

### Text on the board
tNames: VCC | GND | VCC | GND | SDL | SDA | VCC | GND | SDL | SDA | Max487 | 5V | easyGW BluePill 0.2 / RS485, RFM69, RFM95 | UREG | GND | 5V | SDA | VCC | GND | SDL
bNames: 150R | - B A + | - B A + | RS485 | PluepillGW V01 / RS485, RFM69, RFM95 | Module 2